# EAGLE design Veroboard for ckt designing_2 (EAGLE 7.7.0)

## Sheet 1 of 2

## Sheet 2 of 2
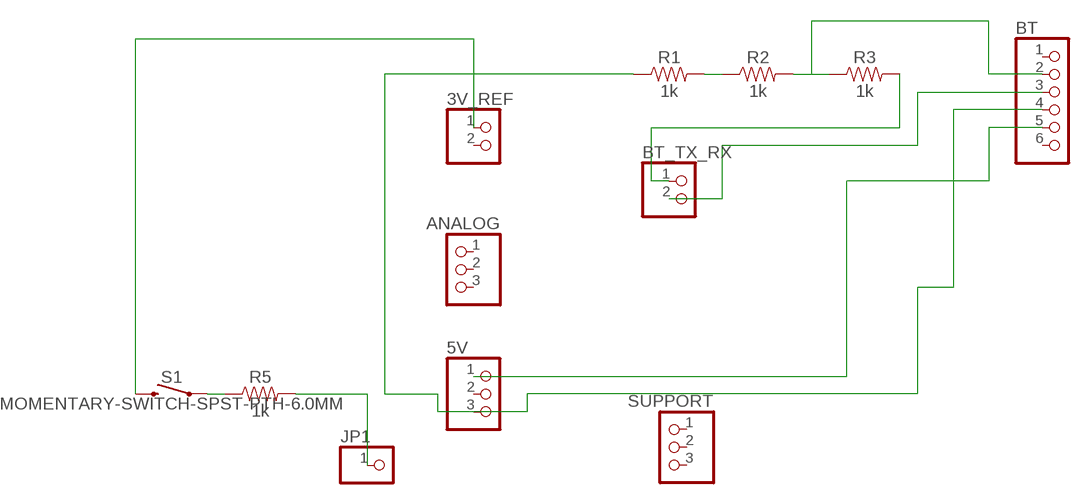
[diagram p0: schematic, sheet 2]

### Parts
3V_REF  PINHD-1X2  [1X02]
5V  PINHD-1X3  [1X03]
ANALOG  PINHD-1X3  [1X03]
BT  PINHD-1X6  [1X06]
BT_TX_RX  PINHD-1X2  [1X02]
JP1  PINHD-1X1  [1X01]
R1  1k  1KOHM-HORIZ-1/4W-1%  [AXIAL-0.3]
R2  1k  1KOHM-HORIZ-1/4W-1%  [AXIAL-0.3]
R3  1k  1KOHM-HORIZ-1/4W-1%  [AXIAL-0.3]
R5  1k  1KOHM-HORIZ-1/4W-1%  [AXIAL-0.3]
S1  MOMENTARY-SWITCH-SPST-PTH-6.0MM  [TACTILE_SWITCH_PTH_6.0MM]
SUPPORT  PINHD-1X3  [1X03]

### Nets
3V: 3V_REF.1 S1.3
5V: 5V.1 BT.5
BT_TX: BT.3 BT_TX_RX.2
G: 5V.3 BT.4 R1.P$1
N$1: R1.P$2 R2.P$1
N$2: BT.2 R2.P$2 R3.P$1
N$3: R5.P$1 S1.1
N$4: JP1.1 R5.P$2
RX: BT_TX_RX.1 R3.P$2
Unconnected: 3V_REF.2 5V.2 ANALOG.1 ANALOG.2 ANALOG.3 BT.1 BT.6 SUPPORT.1 SUPPORT.2 SUPPORT.3

## Library data of the parts
3V_REF BT_TX_RX = pinhead:PINHD-1X2: PIN HEADER
5V ANALOG SUPPORT = pinhead:PINHD-1X3: PIN HEADER
BT = pinhead:PINHD-1X6: PIN HEADER
JP1 = pinhead:PINHD-1X1: PIN HEADER
R1-R3 R5 = SparkFun-Resistors:1KOHM: 1kΩ resistor A resistor is a passive two-terminal electrical component that implements electrical resistance as a circuit element. Resistors act to reduce current flow, and, at the same time, act to lower voltage levels within circuits. - Wikipedia; PROD_ID: RES-12182
S1 = SparkFun-Switches:MOMENTARY-SWITCH-SPST: Momentary Switch (Pushbutton) - SPST Normally-open (NO) SPST momentary switches (buttons, pushbuttons). Variants PTH-12MM - 12mm square, through-hole Momentary Pushbutton Switch - 12mm Square <https://www.sparkfun.com/products/9190> (COM-09190) PTH-6.0MM, PTH-6.0MM-KIT - 6.0mm square, through-hole Mini Pushbutton Switch <https://www.sparkfun.com/products/97> (COM-00097) KIT package intended for soldering kit's - only one side of pads' copper is exposed. PTH-RIGHT-ANGLE-KIT - Right-angle, through-hole Right Angle Tactile Button <https://www.sparkfun.com/products/10791> - Used on SparkFun BigTime Watch Kit <https://www.sparkfun.com/products/11734> SMD-12MM - 12mm square, surface-mount Tactile Button - SMD (12mm) <https://www.sparkfun.com/products/12993> (COM-12993) Used on SparkFun PicoBoard <https://www.sparkfun.com/products/11888> SMD-4.5MM - 4.5mm Square Trackball Switch Used on SparkFun Blackberry Trackballer Breakout <https://www.sparkfun.com/products/13169> SMD-4.6MMX2.8MM - 4.60mm x 2.80mm, surface mount Used on SparkFun SAMD21 Mini Breakout <https://www.sparkfun.com/products/13664> SMD-5.2MM, SMD-5.2-REDUNDANT - 5.2mm square, surface-mount Mini Pushbutton Switch - SMD <https://www.sparkfun.com/products/8720> (COM-08720) Used on Arduino Pro Mini <https://www.sparkfun.com/products/11114> REDUNDANT package connects both switch circuits together SMD-6.0X3.5MM - 6.0 x 3.5mm, surface mount Momentary Reset Switch SMD <https://www.sparkfun.com/products/8229> (COM-08229) SMD-6.2MM-TALL - 6.2mm square, surface mount Tactile Button - SMD (6mm) <https://www.sparkfun.com/products/12992> Used on SparkFun Digital Sandbox <https://www.sparkfun.com/products/12651> SMD-RIGHT-ANGLE - Right-angle, surface mount Used on SparkFun Block for Intel® Edison - Arduino <https://www.sparkfun.com/products/13036>; PROD_ID: SWCH-08441; SF_SKU: COM-00097

## Board
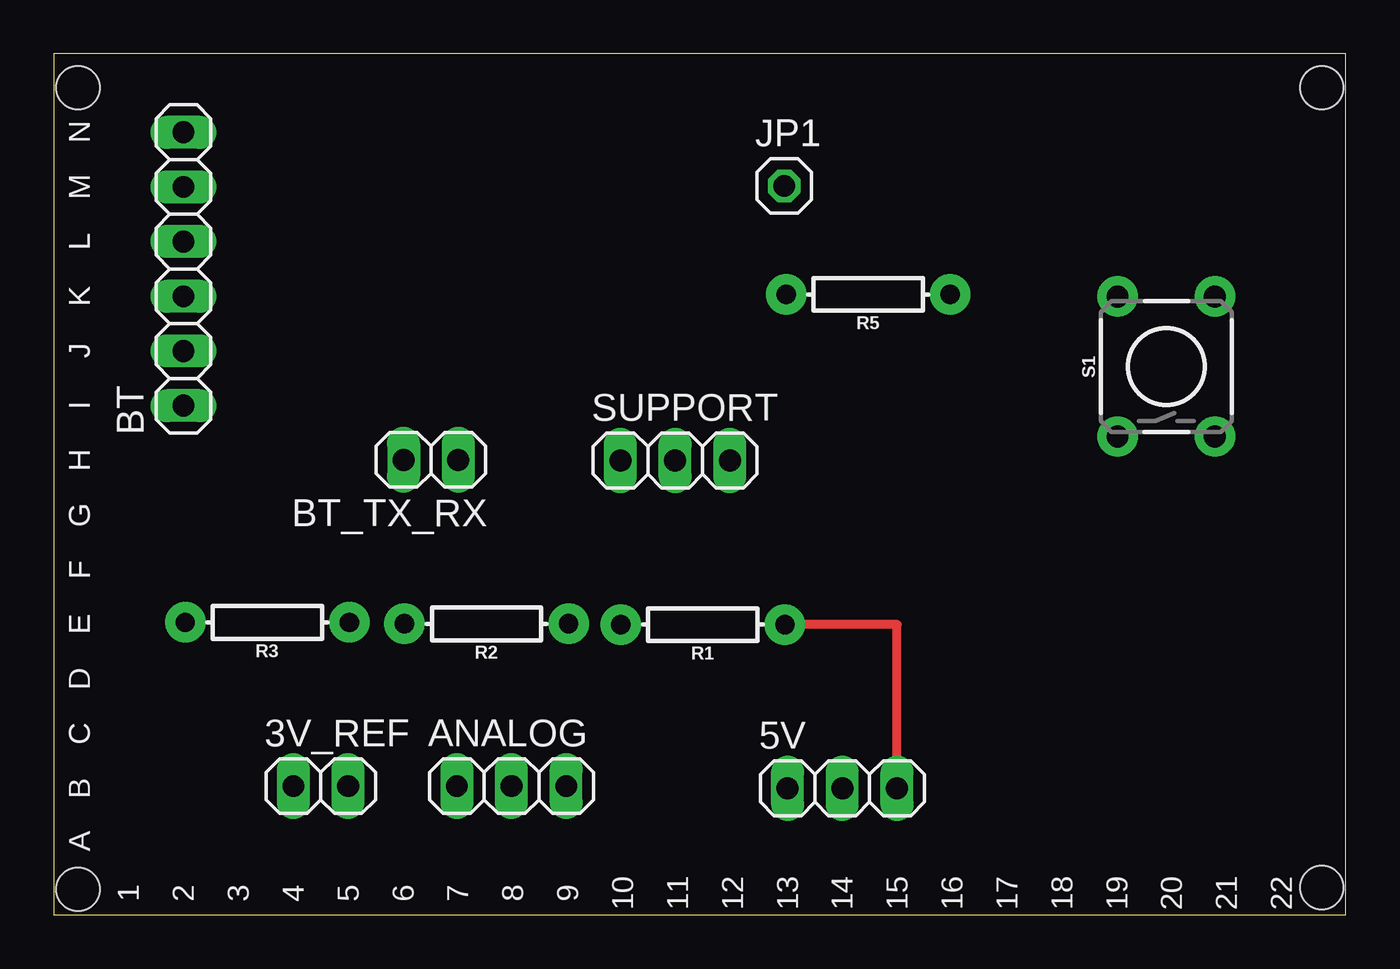
[diagram p1: board, top side]
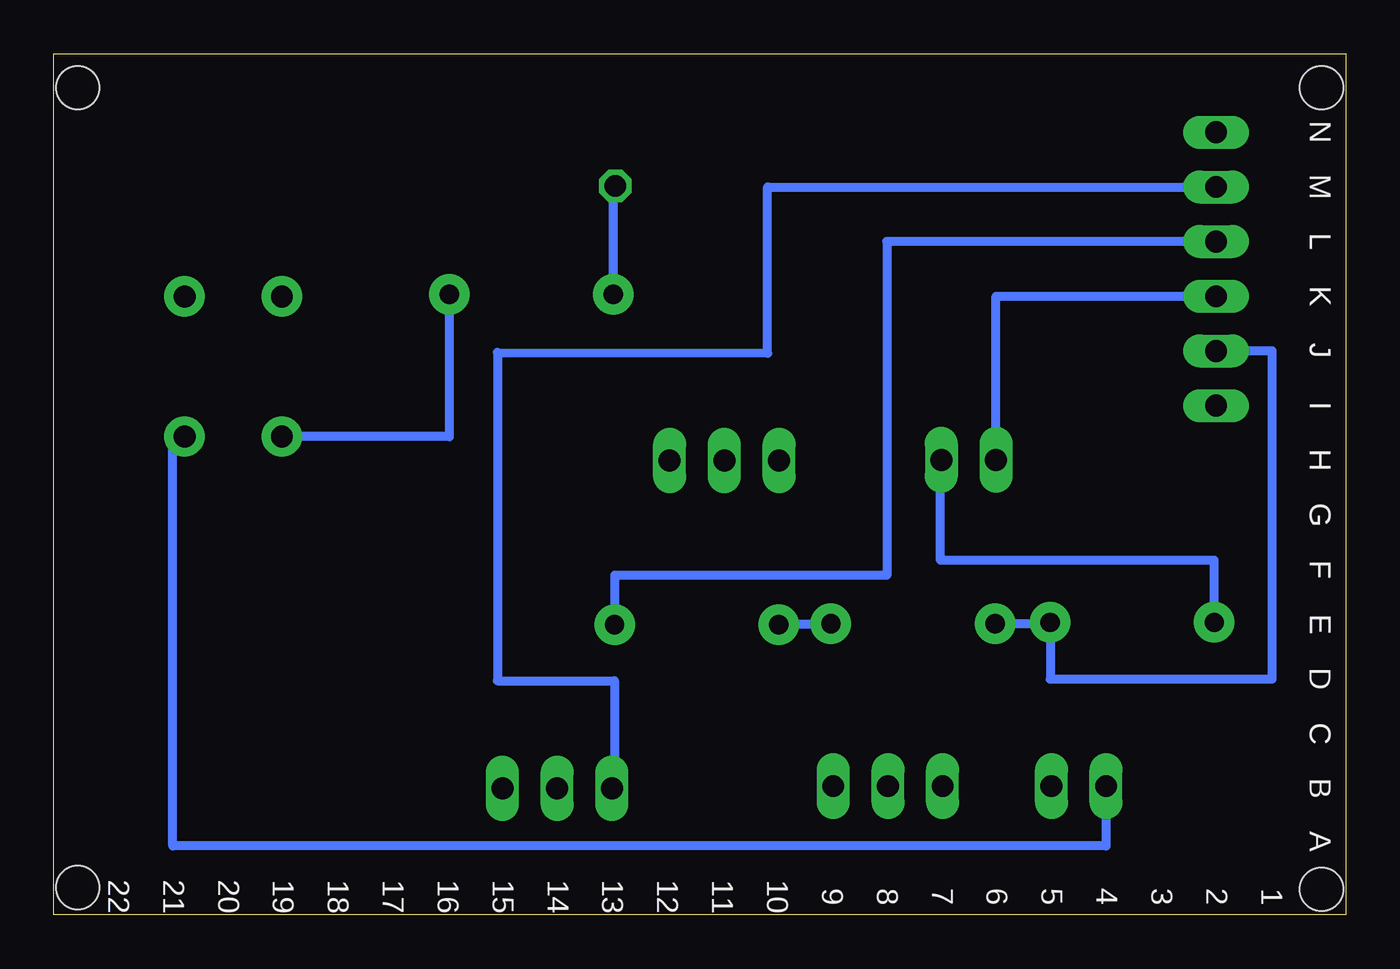
[diagram p2: board, bottom side, seen from below]

Size 60 x 40 mm. Coordinates in mm from the lower left corner, seen from the top.
Outline: 0,0 60,0 60,40 0,40 0,0
Copper layers (1*16): Top 0.035mm / dielectric 1.5mm / Bottom 0.035mm
Design rules "default": minimum track width 10mil, minimum drill 24mil, track to track 8mil, track to pad 8mil, pad to pad 8mil, via to via 8mil, smd to smd 8mil, copper to edge 40mil, drill to drill 8mil, minimum pad ring 10mil, minimum via ring 8mil, stop-mask expansion 4mil, vias tented up to drill 0mil, thermal gap 10mil
Holes 2 mm at 58.89,1.27 58.89,38.43 1.12,1.19 1.12,38.43

### Footprints (pad centres in the part's own frame; a part is rotated, then mirrored left to right if it is on the bottom)
1X02 = drill 1.016 long: 1 -1.27,0; 2 1.27,0
1X03 = drill 1.016 long: 1 -2.54,0; 2 0,0; 3 2.54,0
1X06 = drill 1.016 long: 1 -6.35,0; 2 -3.81,0; 3 -1.27,0; 4 1.27,0; 5 3.81,0; 6 6.35,0
1X01 = drill 1.016 octagon: 1 0,0
AXIAL-0.3 = drill 0.9 pad 1.88: P$1 -3.81,0; P$2 3.81,0
TACTILE_SWITCH_PTH_6.0MM = drill 1.016 pad 1.88: 1 -3.251,2.261; 2 3.251,2.261; 3 -3.251,-2.261; 4 3.251,-2.261

### Placement (x,y rotation side)
3V_REF  12.4,5.99 0 top
5V  36.62,5.88 0 top
ANALOG  21.26,5.99 0 top
BT  6.02,30.01 90 top
BT_TX_RX  17.51,21.14 180 top
JP1  33.92,33.86 0 top
R1  30.15,13.48 180 top
R2  20.1,13.52 180 top
R3  9.91,13.59 180 top
R5  37.82,28.83 180 top
S1  51.67,25.47 90 top
SUPPORT  28.86,21.11 0 top
U$1  [1X14]  3.54,19.86 90 top
U$2  [1X14]  6.08,19.86 90 top
U$3  [1X14]  8.62,19.86 90 top
U$4  [1X14]  11.16,19.86 90 top
U$5  [1X14]  13.7,19.86 90 top
U$6  [1X14]  16.24,19.86 90 top
U$7  [1X14]  18.78,19.86 90 top
U$8  [1X14]  21.32,19.86 90 top
U$9  [1X14]  23.86,19.86 90 top
U$10  [1X14]  26.4,19.86 90 top
U$11  [1X14]  28.94,19.86 90 top
U$12  [1X14]  31.48,19.86 90 top
U$13  [1X14]  34.02,19.86 90 top
U$14  [1X14]  36.56,19.86 90 top
U$15  [1X14]  39.1,19.86 90 top
U$16  [1X14]  41.64,19.86 90 top
U$17  [1X14]  44.18,19.86 90 top
U$18  [1X14]  46.72,19.86 90 top
U$19  [1X14]  49.26,19.86 90 top
U$20  [1X14]  51.8,19.86 90 top
U$21  [1X14]  54.34,19.86 90 top
U$22  [1X14]  56.88,19.86 90 top

### Tracks (layer width: path | path; a pad name or v marks a point on that pad's centre or on a via)
3V
  Bottom 0.406: 3V_REF.1 11.13,3.2 54.47,3.2 54.47,22.22 S1.3
5V
  Bottom 0.406: BT.5 26.84,33.82 26.84,26.1 39.4,26.13 39.4,10.88 33.97,10.88 33.97,5.88 5V.1
BT_TX
  Bottom 0.406: BT_TX_RX.2 16.24,28.74 BT.3
G  (via drill 0.6)
  Top 0.406: 5V.3 39.16,13.48 R1.P$1
  Bottom 0.406: v34.01,13.48 R1.P$1 33.96,15.77 21.31,15.77 21.31,31.28 BT.4
N$1
  Bottom 0.406: R2.P$1 23.91,13.48 R1.P$2
N$2
  Bottom 0.406: R2.P$2 13.72,13.52 R3.P$1 13.72,10.96 3.42,10.96 3.42,26.2 BT.2
N$3
  Bottom 0.406: R5.P$1 41.63,22.22 S1.1
N$4
  Bottom 0.406: R5.P$2 34.01,33.86 JP1.1
RX
  Bottom 0.406: R3.P$2 6.1,16.47 18.82,16.47 18.82,21.14 BT_TX_RX.1

### Text on the board
tNames: N | M | L | K | J | I | H | G | F | E | D | C | B | A | 1 / 2 / 3 / 4 / 5 / 6 / 7 / 8 / 9 / 10 / 11 / 12 / 13 / 14 / 15 / 16 / 17 / 18 / 19 / 20 / 21 / 22
bNames: N | M | L | K | J | I | H | G | F | E | D | C | B | A | 1 / 2 / 3 / 4 / 5 / 6 / 7 / 8 / 9 / 10 / 11 / 12 / 13 / 14 / 15 / 16 / 17 / 18 / 19 / 20 / 21 / 22